# Altium schematic sheet ADC-POWER SUPPLY 2.SchDoc: <SPECIFIC SHEET FUNCTION>
size A3; Date: DO NOT USE, RATHER USE PROJ OPTIONS; DrawnBy: DO NOT USE, RATHER USE PROJ OPTIONS; Engineer: DO NOT USE, RATHER USE PROJ OPTIONS; Organization: DO NOT USE, RATHER USE PROJ OPTIONS; DocumentNumber: 12; Revision: DO NOT USE, RATHER USE PROJ OPTIONS; SheetNumber: 12; SheetTotal: 12; SCH_Sheet_Filename: ADC-POWER SUPPLY 2.SchDoc; CurrentTime: DO NOT USE, RATHER USE PROJ OPTIONS; Time: DO NOT USE, RATHER USE PROJ OPTIONS; DocumentFullPathAndName: DO NOT USE, RATHER USE PROJ OPTIONS; DocumentName: DO NOT USE, RATHER USE PROJ OPTIONS; ModifiedDate: DO NOT USE, RATHER USE PROJ OPTIONS; ImagePath: DO NOT USE, RATHER USE PROJ OPTIONS
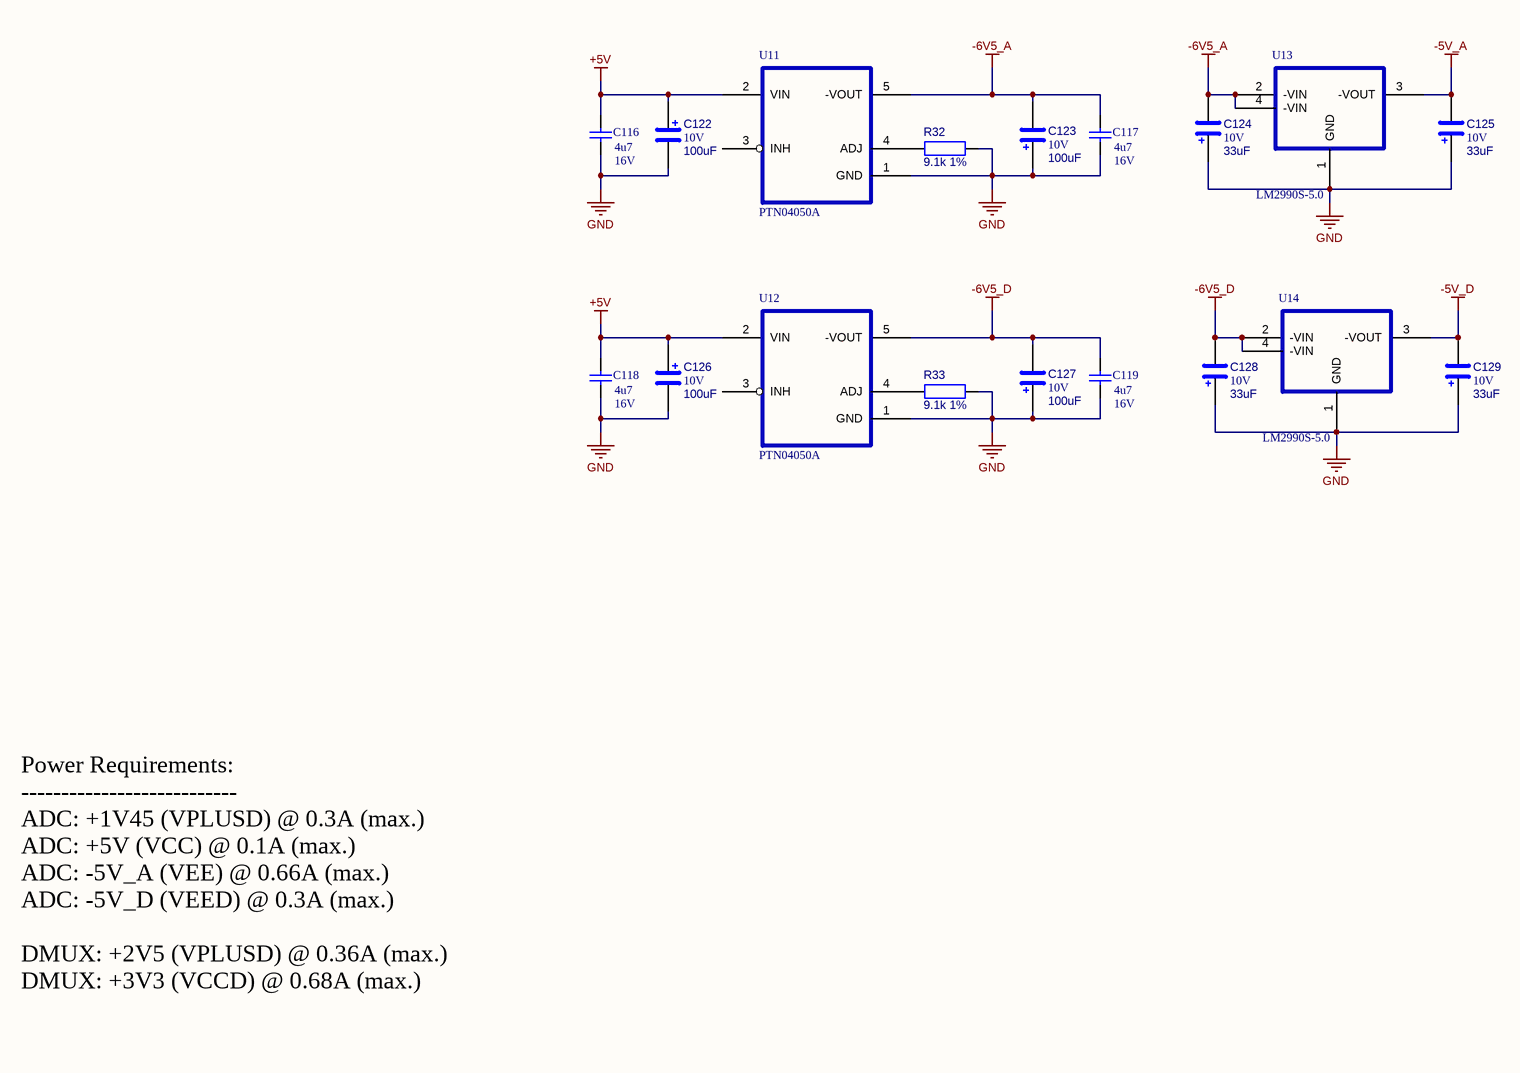
[diagram p0: ADC-POWER SUPPLY 2.SchDoc]

## Parts
C116  value 4u7  Voltage: 16V  [CAPC3225X220N]  (hidden comment: Capacitor 1210 SMD)
C117  value 4u7  Voltage: 16V  [CAPC3225X220N]  (hidden comment: Capacitor 1210 SMD)
C118  value 4u7  Voltage: 16V  [CAPC3225X220N]  (hidden comment: Capacitor 1210 SMD)
C119  value 4u7  Voltage: 16V  [CAPC3225X220N]  (hidden comment: Capacitor 1210 SMD)
C122  Voltage: 10V  [3528]  (hidden comment: 100uF)
C123  Voltage: 10V  [3528]  (hidden comment: 100uF)
C124  Voltage: 10V  [3528]  (hidden comment: 33uF)
C125  Voltage: 10V  [3528]  (hidden comment: 33uF)
C126  Voltage: 10V  [3528]  (hidden comment: 100uF)
C127  Voltage: 10V  [3528]  (hidden comment: 100uF)
C128  Voltage: 10V  [3528]  (hidden comment: 33uF)
C129  Voltage: 10V  [3528]  (hidden comment: 33uF)
R32  9.1k 1%  [0603]
R33  9.1k 1%  [0603]
U11  PTN04050A  [TI_EUU]
U12  PTN04050A  [TI_EUU]
U13  LM2990S-5.0  [TI_TO-263-3]
U14  LM2990S-5.0  [TI_TO-263-3]

## Nets
+5V: C116.2 C118.2 C122.1 C126.1 U11.2(VIN) U12.2(VIN)
-5V_A: C125.2 U13.3(-VOUT)
-5V_D: C129.2 U14.3(-VOUT)
-6V5_A: C117.2 C123.2 C124.2 U11.5(-VOUT) U13.2(-VIN) U13.4(-VIN)
-6V5_D: C119.2 C127.2 C128.2 U12.5(-VOUT) U14.2(-VIN) U14.4(-VIN)
GND: C116.1 C117.1 C118.1 C119.1 C122.2 C123.1 C124.1 C125.1 C126.2 C127.1 C128.1 C129.1 R32.2 R33.2 U11.1(GND) U12.1(GND) U13.1(GND) U14.1(GND)
NetR32_1: R32.1 U11.4(ADJ)
NetR33_1: R33.1 U12.4(ADJ)

Not connected (* = marked no-connect by the designer): U11 3(INH); U12 3(INH)

## Notes on the sheet
- Power Requirements:
  ---------------------------
  ADC: +1V45 (VPLUSD) @ 0.3A (max.)
  ADC: +5V (VCC) @ 0.1A (max.)
  ADC: -5V_A (VEE) @ 0.66A (max.)
  ADC: -5V_D (VEED) @ 0.3A (max.)
  DMUX: +2V5 (VPLUSD) @ 0.36A (max.)
  DMUX: +3V3 (VCCD) @ 0.68A (max.)
- 2009   THIS DOCUMENT IS THE PROPERTY OF THE OWNER, AND MAY NOT BE COPIED OR USED FOR ANY PURPOSE OTHER THAN THAT FOR WHICH IT IS SUPPLIED WITHOUT PERMISSION IN WRITING FROM THE OWNER.
- C
- DATESTAMP OF THIS PRINT
- DRAWN BY:
- DOCUMENT NUMBER:
- SCHEMATIC FILENAME:
- PCB FILENAME:
- ENGINEER:
- APPROVED:
- CIRCUIT DIAGRAM
- DATE
- SHEET
- REVISION
- OF

## Library data of the parts
C116-C119 = cap1210: Created_By: EDA-ASA; Checked_By: *; Checked_Date: *; HelpURL: *; Supplier1: *; Supplier2: *; Unit_Cost: *; MOQ: *; Leadtime: *; Inventory_Stock: *; Tolerance: *; Wattage: *; Package: 1210; ComponentLinked1Description: *; ComponentLinked1URL: *; ComponentLinked2Description: *; ComponentLinked2URL: *; ComponentLinked3Description: *; ComponentLinked3URL: *; ComponentLinked4Description: *; ComponentLinked4URL: *
C122-C129 = CAPACITOR-POLARISED: Created_By: EDA-ASA; Checked_By: *; Checked_Date: *; HelpURL: *; ComponentLinked1Description: *; ComponentLinked1URL: *; ComponentLinked2Description: *; ComponentLinked2URL: *; ComponentLinked3Description: *; ComponentLinked3URL: *; ComponentLinked4Description: *; ComponentLinked4URL: *; Supplier1: *; Supplier2: *; Unit_Cost: *; MOQ: *; Leadtime: *; Inventory_Stock: *; Tolerance: *; Wattage: *
  C122 C123 C126 C127: Value: 100uF
  C124 C125 C128 C129: Value: 33uF
R32 R33 = RES-0805: RESISTOR SMD 0603; Checked_By: NN; Manufacturer: *; Manufacturer_PN: *; Created_By: *; Checked_Date: 5-08-2009; HelpURL: *; ComponentLink1Description: Footprint Detail; ComponentLink1URL: *; ComponentLink2Description: Application Note; ComponentLink2URL: *; ComponentLink3Description: Layout Guidelines; ComponentLink3URL: *; ComponentLink4Description: Technology Reference; ComponentLink4URL: *; Supplier1: *; Supplier2: *; Unit_Cost: *; MOQ: *; Leadtime: *; Inventory_Stock: *; Tolerance: *; Wattage: *; Voltage: *; Package: 0603; ComponentLink5Description: Production Detail; ComponentLink5URL: *; Note: *; Stock Code: *; Value: 9.1k 1%